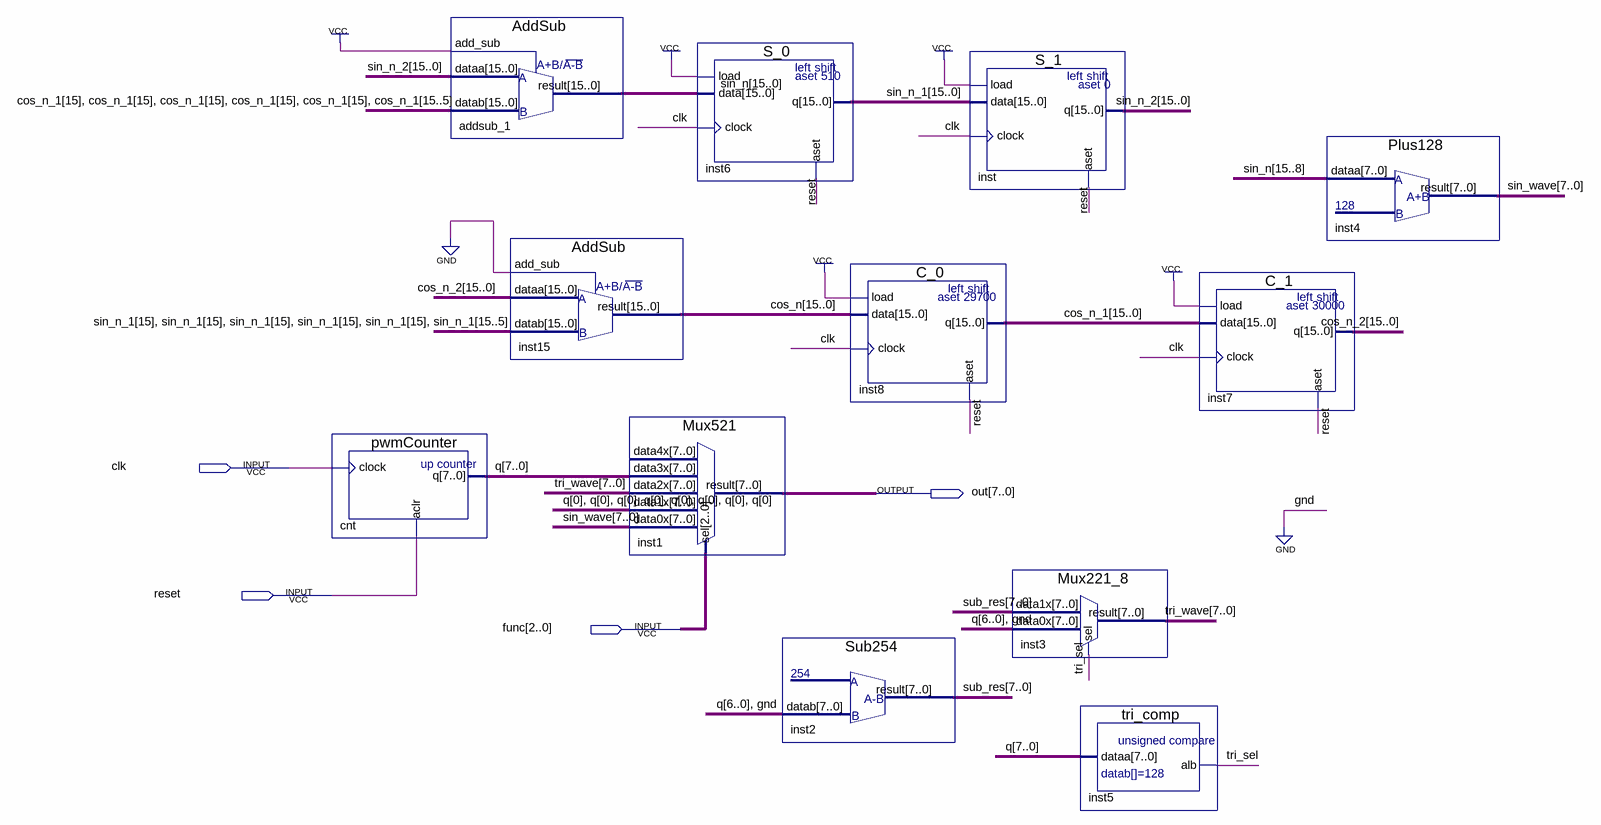
[diagram p0: schematic sheet]
// Quartus schematic DigFuncGen.bdf as structural Verilog: 12 symbols, 4 pins
module DigFuncGen (
  input  clk,
  input  reset,
  input  [2:0] func,
  output [7:0] out
);

  wire tri_sel;
  wire [7:0] q, sin_wave, sub_res, tri_wave;
  wire [15:0] cos_n, cos_n_1, cos_n_2, sin_n, sin_n_1, sin_n_2;

  pwmCounter cnt (.clock(clk), .aclr(reset), .q(q));
  AddSub addsub_1 (.add_sub(1'b1), .dataa(sin_n_2), .datab({{6{cos_n_1[15]}}, cos_n_1[14:5]}), .result(sin_n));
  AddSub inst15 (.add_sub(1'b0), .dataa(cos_n_2), .datab({{6{sin_n_1[15]}}, sin_n_1[14:5]}), .result(cos_n));
  Mux521 inst1 (
    .data3x(q), .data2x(tri_wave), .data1x({8{q[0]}}), .data0x(sin_wave), .sel(func), .result(out));  // open: data4x
  S_0 inst6 (.load(1'b1), .data(sin_n), .clock(clk), .aset(reset), .q(sin_n_1));
  Sub254 inst2 (.datab({q[6:0], 1'b0}), .result(sub_res));
  C_0 inst8 (.load(1'b1), .data(cos_n), .clock(clk), .aset(reset), .q(cos_n_1));
  S_1 inst (.load(1'b1), .data(sin_n_1), .clock(clk), .aset(reset), .q(sin_n_2));
  Mux221_8 inst3 (.data1x(sub_res), .data0x({q[6:0], 1'b0}), .sel(tri_sel), .result(tri_wave));
  tri_comp inst5 (.dataa(q), .alb(tri_sel));
  C_1 inst7 (.load(1'b1), .data(cos_n_1), .clock(clk), .aset(reset), .q(cos_n_2));
  Plus128 inst4 (.dataa(sin_n[15:8]), .result(sin_wave));
endmodule
